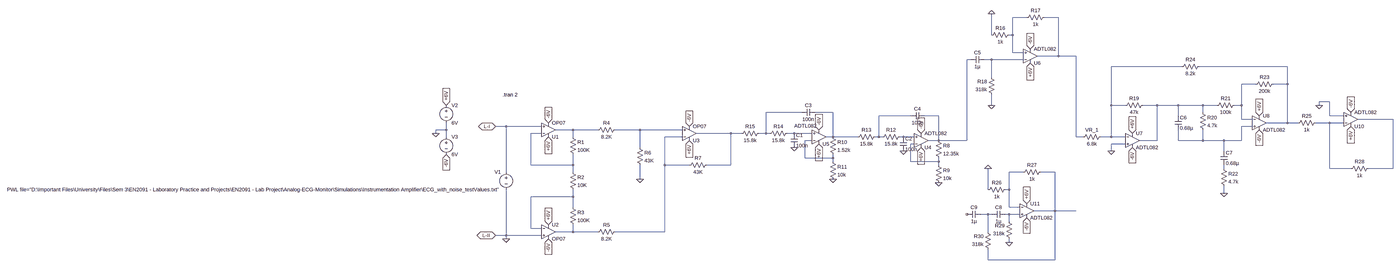
[diagram p0: schematic final_setup.asc, whole sheet]
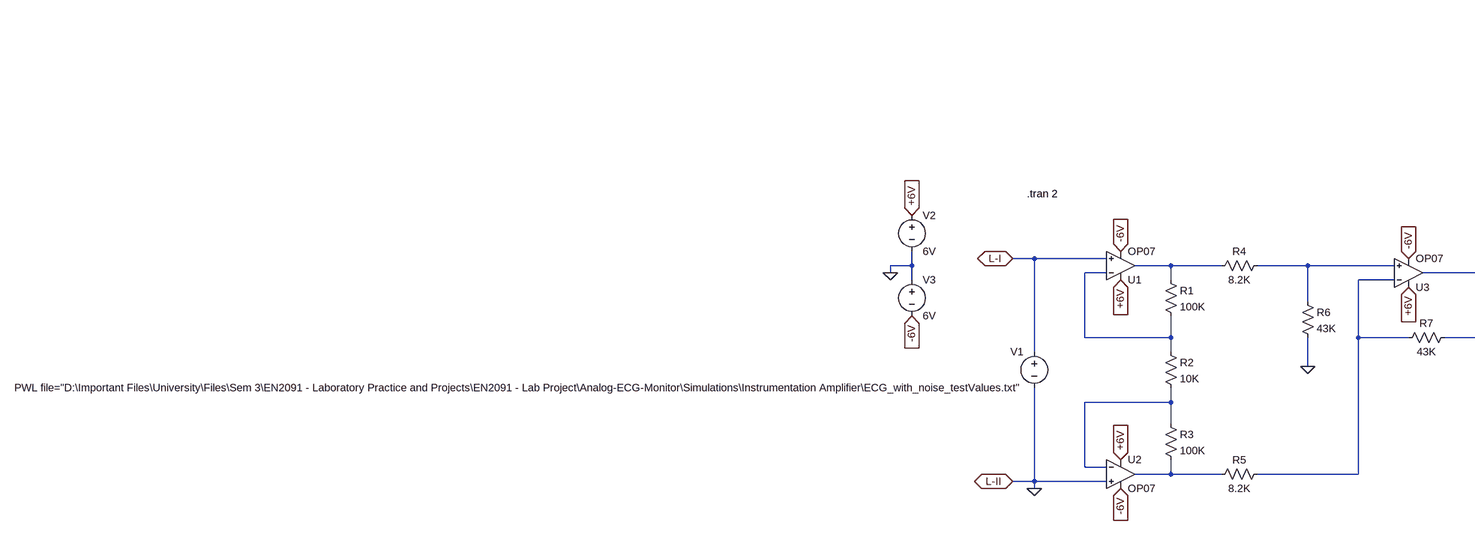
[diagram p1: schematic final_setup.asc, part, row 1 of 1, column 1 of 2]
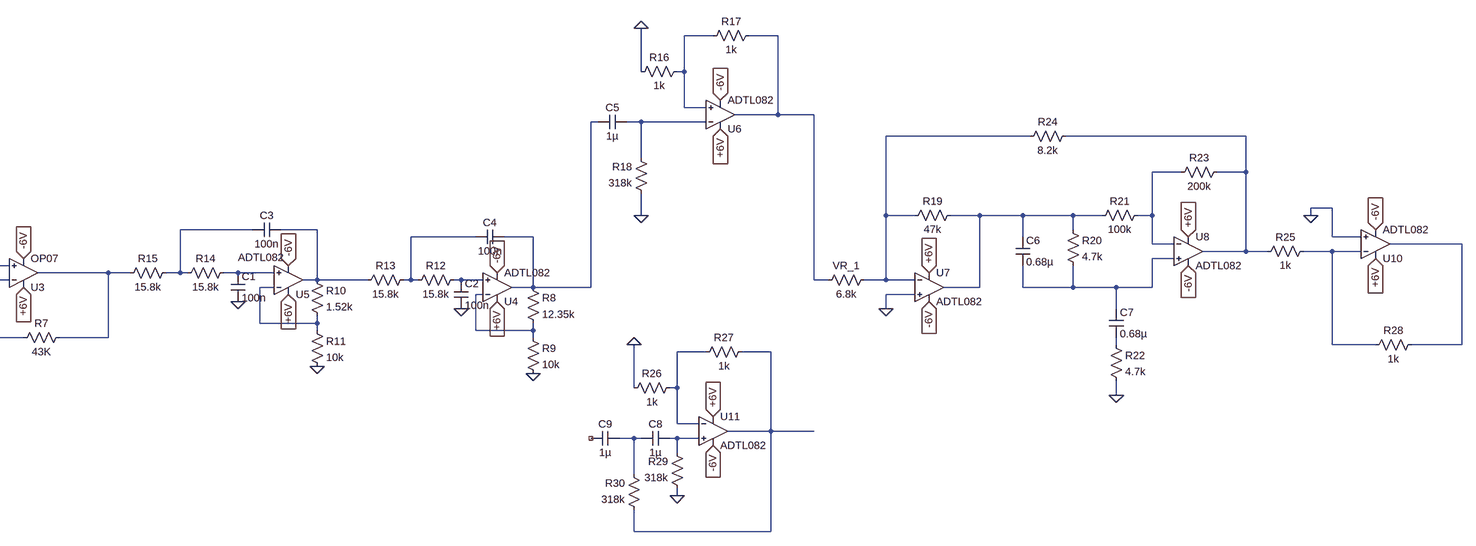
[diagram p2: schematic final_setup.asc, part, row 1 of 1, column 2 of 2]
final_setup.asc, the LTspice schematic file:
Version 4.1
SHEET 1 3252 932
WIRE 1584 -576 1520 -576
WIRE 1728 -576 1664 -576
WIRE 1424 -496 1424 -592
WIRE 1520 -496 1520 -576
WIRE 1520 -496 1504 -496
WIRE 1520 -416 1520 -496
WIRE 1568 -416 1520 -416
WIRE 1728 -400 1728 -576
WIRE 1728 -400 1632 -400
WIRE 1808 -400 1728 -400
WIRE 1328 -384 1312 -384
WIRE 1424 -384 1392 -384
WIRE 1568 -384 1424 -384
WIRE 2288 -352 1968 -352
WIRE 2768 -352 2368 -352
WIRE 1424 -304 1424 -384
WIRE 2624 -272 2560 -272
WIRE 2768 -272 2768 -352
WIRE 2768 -272 2704 -272
WIRE 2960 -192 2912 -192
WIRE 1424 -176 1424 -224
WIRE 1968 -176 1968 -352
WIRE 2032 -176 1968 -176
WIRE 2176 -176 2112 -176
WIRE 2272 -176 2176 -176
WIRE 2384 -176 2272 -176
WIRE 2448 -176 2384 -176
WIRE 2560 -176 2560 -272
WIRE 2560 -176 2528 -176
WIRE 2912 -176 2912 -192
WIRE 560 -144 400 -144
WIRE 704 -144 624 -144
WIRE 2384 -144 2384 -176
WIRE 1056 -128 912 -128
WIRE 1184 -128 1120 -128
WIRE 2272 -128 2272 -176
WIRE 2960 -128 2960 -192
WIRE 3024 -128 2960 -128
WIRE 2560 -112 2560 -176
WIRE 2608 -112 2560 -112
WIRE 3248 -112 3088 -112
WIRE 2768 -96 2768 -272
WIRE 2768 -96 2672 -96
WIRE 2816 -96 2768 -96
WIRE 2960 -96 2896 -96
WIRE 3024 -96 2960 -96
WIRE -784 -80 -832 -80
WIRE -624 -80 -784 -80
WIRE 2608 -80 2560 -80
WIRE -1056 -64 -1056 -96
WIRE -1056 -64 -1104 -64
WIRE -480 -64 -560 -64
WIRE -368 -64 -480 -64
WIRE -176 -64 -288 -64
WIRE 16 -64 -176 -64
WIRE -1104 -48 -1104 -64
WIRE -624 -48 -672 -48
WIRE 240 -48 80 -48
WIRE 288 -48 240 -48
WIRE 400 -48 400 -144
WIRE 400 -48 368 -48
WIRE 416 -48 400 -48
WIRE 528 -48 496 -48
WIRE 608 -48 528 -48
WIRE -1056 -32 -1056 -64
WIRE -480 -32 -480 -64
WIRE 16 -32 -64 -32
WIRE 704 -32 704 -144
WIRE 704 -32 672 -32
WIRE 816 -32 704 -32
WIRE 912 -32 912 -128
WIRE 912 -32 896 -32
WIRE 928 -32 912 -32
WIRE 1024 -32 1008 -32
WIRE 1072 -32 1024 -32
WIRE 1808 -32 1808 -400
WIRE 1840 -32 1808 -32
WIRE 1968 -32 1968 -176
WIRE 1968 -32 1920 -32
WIRE 2032 -32 1968 -32
WIRE 608 -16 576 -16
WIRE 1184 -16 1184 -128
WIRE 1184 -16 1136 -16
WIRE 1312 -16 1312 -384
WIRE 1312 -16 1184 -16
WIRE 2176 -16 2176 -176
WIRE 2176 -16 2096 -16
WIRE 2272 -16 2272 -64
WIRE 2384 -16 2384 -64
WIRE 2384 -16 2272 -16
WIRE 2480 -16 2384 -16
WIRE 2560 -16 2560 -80
WIRE 2560 -16 2480 -16
WIRE 1072 0 1056 0
WIRE 2032 0 1968 0
WIRE -176 16 -176 -64
WIRE 1968 32 1968 0
WIRE 2480 32 2480 -16
WIRE 576 64 576 -16
WIRE 704 64 704 48
WIRE 704 64 576 64
WIRE 704 80 704 64
WIRE 1056 80 1056 0
WIRE 1184 80 1184 64
WIRE 1184 80 1056 80
WIRE -672 96 -672 -48
WIRE -480 96 -480 48
WIRE -480 96 -672 96
WIRE -64 96 -64 -32
WIRE 48 96 -64 96
WIRE 240 96 240 -48
WIRE 240 96 128 96
WIRE 1184 96 1184 80
WIRE 2480 112 2480 96
WIRE 2960 112 2960 -96
WIRE 3056 112 2960 112
WIRE 3248 112 3248 -112
WIRE 3248 112 3136 112
WIRE -784 128 -784 -80
WIRE -480 128 -480 96
WIRE 1568 128 1504 128
WIRE 1712 128 1648 128
WIRE -176 160 -176 96
WIRE 1408 208 1408 112
WIRE 1504 208 1504 128
WIRE 1504 208 1488 208
WIRE 2480 224 2480 192
WIRE -480 240 -480 208
WIRE -480 240 -672 240
WIRE -480 288 -480 240
WIRE 1504 288 1504 208
WIRE 1552 288 1504 288
WIRE 1712 304 1712 128
WIRE 1712 304 1616 304
WIRE 1808 304 1712 304
WIRE 1408 320 1376 320
WIRE 1424 320 1408 320
WIRE 1504 320 1488 320
WIRE 1552 320 1504 320
WIRE 1504 352 1504 320
WIRE -672 384 -672 240
WIRE -624 384 -672 384
WIRE -480 400 -480 368
WIRE -480 400 -560 400
WIRE -368 400 -480 400
WIRE -64 400 -64 96
WIRE -64 400 -288 400
WIRE 1408 400 1408 320
WIRE -784 416 -784 208
WIRE -784 416 -832 416
WIRE -624 416 -784 416
WIRE -784 432 -784 416
WIRE 1504 448 1504 432
WIRE 1408 528 1408 480
WIRE 1712 528 1712 304
WIRE 1712 528 1408 528
FLAG -784 432 0
FLAG -592 -32 +6V
IOPIN -592 -32 In
FLAG -592 368 +6V
IOPIN -592 368 In
FLAG -592 -96 -6V
IOPIN -592 -96 In
FLAG -592 432 -6V
IOPIN -592 432 In
FLAG -176 160 0
FLAG 48 -16 +6V
IOPIN 48 -16 In
FLAG 48 -80 -6V
IOPIN 48 -80 In
FLAG -832 -80 L-I
IOPIN -832 -80 BiDir
FLAG -832 416 L-II
IOPIN -832 416 BiDir
FLAG -1104 -48 0
FLAG -1056 -176 +6V
IOPIN -1056 -176 In
FLAG -1056 48 -6V
IOPIN -1056 48 In
FLAG 1184 176 0
FLAG 704 160 0
FLAG 528 16 0
FLAG 1024 32 0
FLAG 640 0 +6V
IOPIN 640 0 In
FLAG 1104 16 +6V
IOPIN 1104 16 In
FLAG 640 -64 -6V
IOPIN 640 -64 In
FLAG 1104 -48 -6V
IOPIN 1104 -48 In
FLAG 1424 -592 0
FLAG 1424 -176 0
FLAG 1600 -432 -6V
IOPIN 1600 -432 In
FLAG 1600 -368 +6V
IOPIN 1600 -368 In
FLAG 2064 -48 +6V
IOPIN 2064 -48 In
FLAG 2640 -128 +6V
IOPIN 2640 -128 In
FLAG 2064 16 -6V
IOPIN 2064 16 In
FLAG 2640 -64 -6V
IOPIN 2640 -64 In
FLAG 1968 32 0
FLAG 2480 224 0
FLAG 3056 -80 +6V
IOPIN 3056 -80 In
FLAG 3056 -144 -6V
IOPIN 3056 -144 In
FLAG 2912 -176 0
FLAG 1504 448 0
FLAG 1408 112 0
FLAG 1584 272 +6V
IOPIN 1584 272 In
FLAG 1584 336 -6V
IOPIN 1584 336 In
SYMBOL OpAmps/OP07 -592 0 M180
SYMATTR InstName U1
SYMBOL Res -496 -48 R0
SYMATTR InstName R1
SYMATTR Value 100K
SYMBOL Res -496 112 R0
SYMATTR InstName R2
SYMATTR Value 10K
SYMBOL Res -496 272 R0
SYMATTR InstName R3
SYMATTR Value 100K
SYMBOL OpAmps/OP07 -592 336 R0
SYMATTR InstName U2
SYMBOL Voltage -784 112 M0
WINDOW 123 0 0 Left 0
WINDOW 39 0 0 Left 0
SYMATTR InstName V1
SYMATTR Value PWL file="D:\Important Files\University\Files\Sem 3\EN2091 - Laboratory Practice and Projects\EN2091 - Lab Project\Analog-ECG-Monitor\Simulations\Instrumentation Amplifier\ECG_with_noise_testValues.txt"
SYMBOL Res -272 -80 R90
WINDOW 0 0 56 VBottom 2
WINDOW 3 32 56 VTop 2
SYMATTR InstName R4
SYMATTR Value 8.2K
SYMBOL Res -272 384 R90
WINDOW 0 0 56 VBottom 2
WINDOW 3 32 56 VTop 2
SYMATTR InstName R5
SYMATTR Value 8.2K
SYMBOL Res -192 0 R0
SYMATTR InstName R6
SYMATTR Value 43K
SYMBOL OpAmps/OP07 48 16 M180
SYMATTR InstName U3
SYMBOL Res 144 80 R90
WINDOW 0 0 56 VBottom 2
WINDOW 3 32 56 VTop 2
SYMATTR InstName R7
SYMATTR Value 43K
SYMBOL Voltage -1056 -192 R0
SYMATTR InstName V2
SYMATTR Value 6V
SYMBOL Voltage -1056 -48 R0
SYMATTR InstName V3
SYMATTR Value 6V
SYMBOL OpAmps\\ADTL082 1104 48 M180
SYMATTR InstName U4
SYMBOL OpAmps\\ADTL082 640 32 M180
WINDOW 3 -112 114 Left 2
SYMATTR InstName U5
SYMBOL res 1168 -32 R0
SYMATTR InstName R8
SYMATTR Value 12.35k
SYMBOL res 1168 80 R0
SYMATTR InstName R9
SYMATTR Value 10k
SYMBOL res 688 -48 R0
SYMATTR InstName R10
SYMATTR Value 1.52k
SYMBOL res 688 64 R0
SYMATTR InstName R11
SYMATTR Value 10k
SYMBOL cap 512 -48 R0
SYMATTR InstName C1
SYMATTR Value 100n
SYMBOL cap 1008 -32 R0
SYMATTR InstName C2
SYMATTR Value 100n
SYMBOL res 1024 -48 R90
WINDOW 0 0 56 VBottom 2
WINDOW 3 32 56 VTop 2
SYMATTR InstName R12
SYMATTR Value 15.8k
SYMBOL res 912 -48 R90
WINDOW 0 0 56 VBottom 2
WINDOW 3 32 56 VTop 2
SYMATTR InstName R13
SYMATTR Value 15.8k
SYMBOL res 512 -64 R90
WINDOW 0 0 56 VBottom 2
WINDOW 3 32 56 VTop 2
SYMATTR InstName R14
SYMATTR Value 15.8k
SYMBOL res 384 -64 R90
WINDOW 0 0 56 VBottom 2
WINDOW 3 32 56 VTop 2
SYMATTR InstName R15
SYMATTR Value 15.8k
SYMBOL cap 624 -160 R90
WINDOW 0 0 32 VBottom 2
WINDOW 3 32 32 VTop 2
SYMATTR InstName C3
SYMATTR Value 100n
SYMBOL cap 1120 -144 R90
WINDOW 0 0 32 VBottom 2
WINDOW 3 32 32 VTop 2
SYMATTR InstName C4
SYMATTR Value 100n
SYMBOL cap 1392 -400 R90
WINDOW 0 0 32 VBottom 2
WINDOW 3 32 32 VTop 2
SYMATTR InstName C5
SYMATTR Value 1µ
SYMBOL res 1520 -512 R90
WINDOW 0 0 56 VBottom 2
WINDOW 3 32 56 VTop 2
SYMATTR InstName R16
SYMATTR Value 1k
SYMBOL res 1680 -592 R90
WINDOW 0 0 56 VBottom 2
WINDOW 3 32 56 VTop 2
SYMATTR InstName R17
SYMATTR Value 1k
SYMBOL res 1440 -208 R180
WINDOW 0 36 76 Left 2
WINDOW 3 36 40 Left 2
SYMATTR InstName R18
SYMATTR Value 318k
SYMBOL OpAmps\\ADTL082 1600 -336 M180
SYMATTR InstName U6
SYMBOL OpAmps\\ADTL082 2064 -80 R0
SYMATTR InstName U7
SYMBOL OpAmps\\ADTL082 2640 -160 R0
SYMATTR InstName U8
SYMBOL res 1936 -48 R90
WINDOW 0 0 56 VBottom 2
WINDOW 3 32 56 VTop 2
SYMATTR InstName VR_1
SYMATTR Value 6.8k
SYMATTR SpiceLine tol=5 pwr=0.25
SYMBOL res 2128 -192 R90
WINDOW 0 0 56 VBottom 2
WINDOW 3 32 56 VTop 2
SYMATTR InstName R19
SYMATTR Value 47k
SYMATTR SpiceLine tol=5 pwr=0.25
SYMBOL cap 2256 -128 R0
SYMATTR InstName C6
SYMATTR Value 0.68µ
SYMATTR SpiceLine V=50
SYMBOL res 2368 -160 R0
SYMATTR InstName R20
SYMATTR Value 4.7k
SYMATTR SpiceLine tol=5 pwr=0.25
SYMBOL res 2544 -192 R90
WINDOW 0 0 56 VBottom 2
WINDOW 3 32 56 VTop 2
SYMATTR InstName R21
SYMATTR Value 100k
SYMATTR SpiceLine tol=5 pwr=0.25
SYMBOL cap 2464 32 R0
SYMATTR InstName C7
SYMATTR Value 0.68µ
SYMATTR SpiceLine V=50
SYMBOL res 2464 96 R0
SYMATTR InstName R22
SYMATTR Value 4.7k
SYMATTR SpiceLine tol=5 pwr=0.25
SYMBOL res 2720 -288 R90
WINDOW 0 0 56 VBottom 2
WINDOW 3 32 56 VTop 2
SYMATTR InstName R23
SYMATTR Value 200k
SYMATTR SpiceLine tol=5 pwr=0.25
SYMBOL res 2384 -368 R90
WINDOW 0 0 56 VBottom 2
WINDOW 3 32 56 VTop 2
SYMATTR InstName R24
SYMATTR Value 8.2k
SYMATTR SpiceLine tol=5 pwr=0.25
SYMBOL OpAmps\\ADTL082 3056 -48 M180
SYMATTR InstName U10
SYMBOL res 2912 -112 R90
WINDOW 0 0 56 VBottom 2
WINDOW 3 32 56 VTop 2
SYMATTR InstName R25
SYMATTR Value 1k
SYMBOL res 3152 96 R90
WINDOW 0 0 56 VBottom 2
WINDOW 3 32 56 VTop 2
SYMATTR InstName R28
SYMATTR Value 1k
SYMBOL cap 1488 304 R90
WINDOW 0 0 32 VBottom 2
WINDOW 3 32 32 VTop 2
SYMATTR InstName C8
SYMATTR Value 1µ
SYMBOL cap 1376 304 R90
WINDOW 0 0 32 VBottom 2
WINDOW 3 32 32 VTop 2
SYMATTR InstName C9
SYMATTR Value 1µ
SYMBOL res 1504 192 R90
WINDOW 0 0 56 VBottom 2
WINDOW 3 32 56 VTop 2
SYMATTR InstName R26
SYMATTR Value 1k
SYMBOL res 1664 112 R90
WINDOW 0 0 56 VBottom 2
WINDOW 3 32 56 VTop 2
SYMATTR InstName R27
SYMATTR Value 1k
SYMBOL res 1520 448 R180
WINDOW 0 36 76 Left 2
WINDOW 3 36 40 Left 2
SYMATTR InstName R29
SYMATTR Value 318k
SYMBOL res 1424 496 R180
WINDOW 0 36 76 Left 2
WINDOW 3 36 40 Left 2
SYMATTR InstName R30
SYMATTR Value 318k
SYMBOL OpAmps\\ADTL082 1584 240 R0
SYMATTR InstName U11
TEXT -800 -224 Left 2 !.tran 2

The netlist it stands for:
* final_setup.asc
X§U1 L-I N017 +6V -6V N015 LT1001  ; OP07, pins In+ In- V+ V- OUT
R1 N015 N017 100K
R2 N017 N027 10K
R3 N027 N030 100K
X§U2 0 N027 +6V -6V N030 LT1001  ; OP07, pins In+ In- V+ V- OUT
V1 L-I 0 PWL file="D:\Important Files\University\Files\Sem 3\EN2091 - Laboratory Practice and Projects\EN2091 - Lab Project\Analog-ECG-Monitor\Simulations\Instrumentation Amplifier\ECG_with_noise_testValues.txt"
R4 N016 N015 8.2K
R5 N020 N030 8.2K
R6 N016 0 43K
X§U3 N016 N020 +6V -6V N018 LT1001  ; OP07, pins In+ In- V+ V- OUT
R7 N018 N020 43K
V2 +6V 0 6V
V3 0 -6V 6V
X§U4 N021 N023 +6V -6V N003 ADTL082  ; pins In+ In- V+ V- OUT
X§U5 N019 N022 +6V -6V N010 ADTL082  ; pins In+ In- V+ V- OUT
R8 N003 N023 12.35k
R9 N023 0 10k
R10 N010 N022 1.52k
R11 N022 0 10k
C1 N019 0 100n
C2 N021 0 100n
R12 N021 N011 15.8k
R13 N011 N010 15.8k
R14 N019 N009 15.8k
R15 N009 N018 15.8k
C3 N010 N009 100n
C4 N003 N011 100n
C5 N004 N003 1µ
R16 N001 0 1k
R17 N002 N001 1k
R18 0 N004 318k
X§U6 N001 N004 +6V -6V N002 ADTL082  ; pins In+ In- V+ V- OUT
X§U7 0 N005 +6V -6V N008 ADTL082  ; pins In+ In- V+ V- OUT
X§U8 N014 N007 +6V -6V N006 ADTL082  ; pins In+ In- V+ V- OUT
R§VR_1 N005 N002 6.8k tol=5 pwr=0.25
R19 N008 N005 47k tol=5 pwr=0.25
C6 N008 N014 0.68µ V=50
R20 N008 N014 4.7k tol=5 pwr=0.25
R21 N007 N008 100k tol=5 pwr=0.25
C7 N014 N024 0.68µ V=50
R22 N024 0 4.7k tol=5 pwr=0.25
R23 N006 N007 200k tol=5 pwr=0.25
R24 N006 N005 8.2k tol=5 pwr=0.25
X§U10 0 N013 +6V -6V N012 ADTL082  ; pins In+ In- V+ V- OUT
R25 N013 N006 1k
R28 N012 N013 1k
C8 N029 N028 1µ
C9 N028 NC_01 1µ
R26 N025 0 1k
R27 N026 N025 1k
R29 0 N029 318k
R30 N026 N028 318k
X§U11 N029 N025 +6V -6V N026 ADTL082  ; pins In+ In- V+ V- OUT
.tran 2
.lib LTC.lib
.lib ADI.lib
.backanno
.end